# EAGLE design PentaFnord_0_2b (EAGLE 5.11)
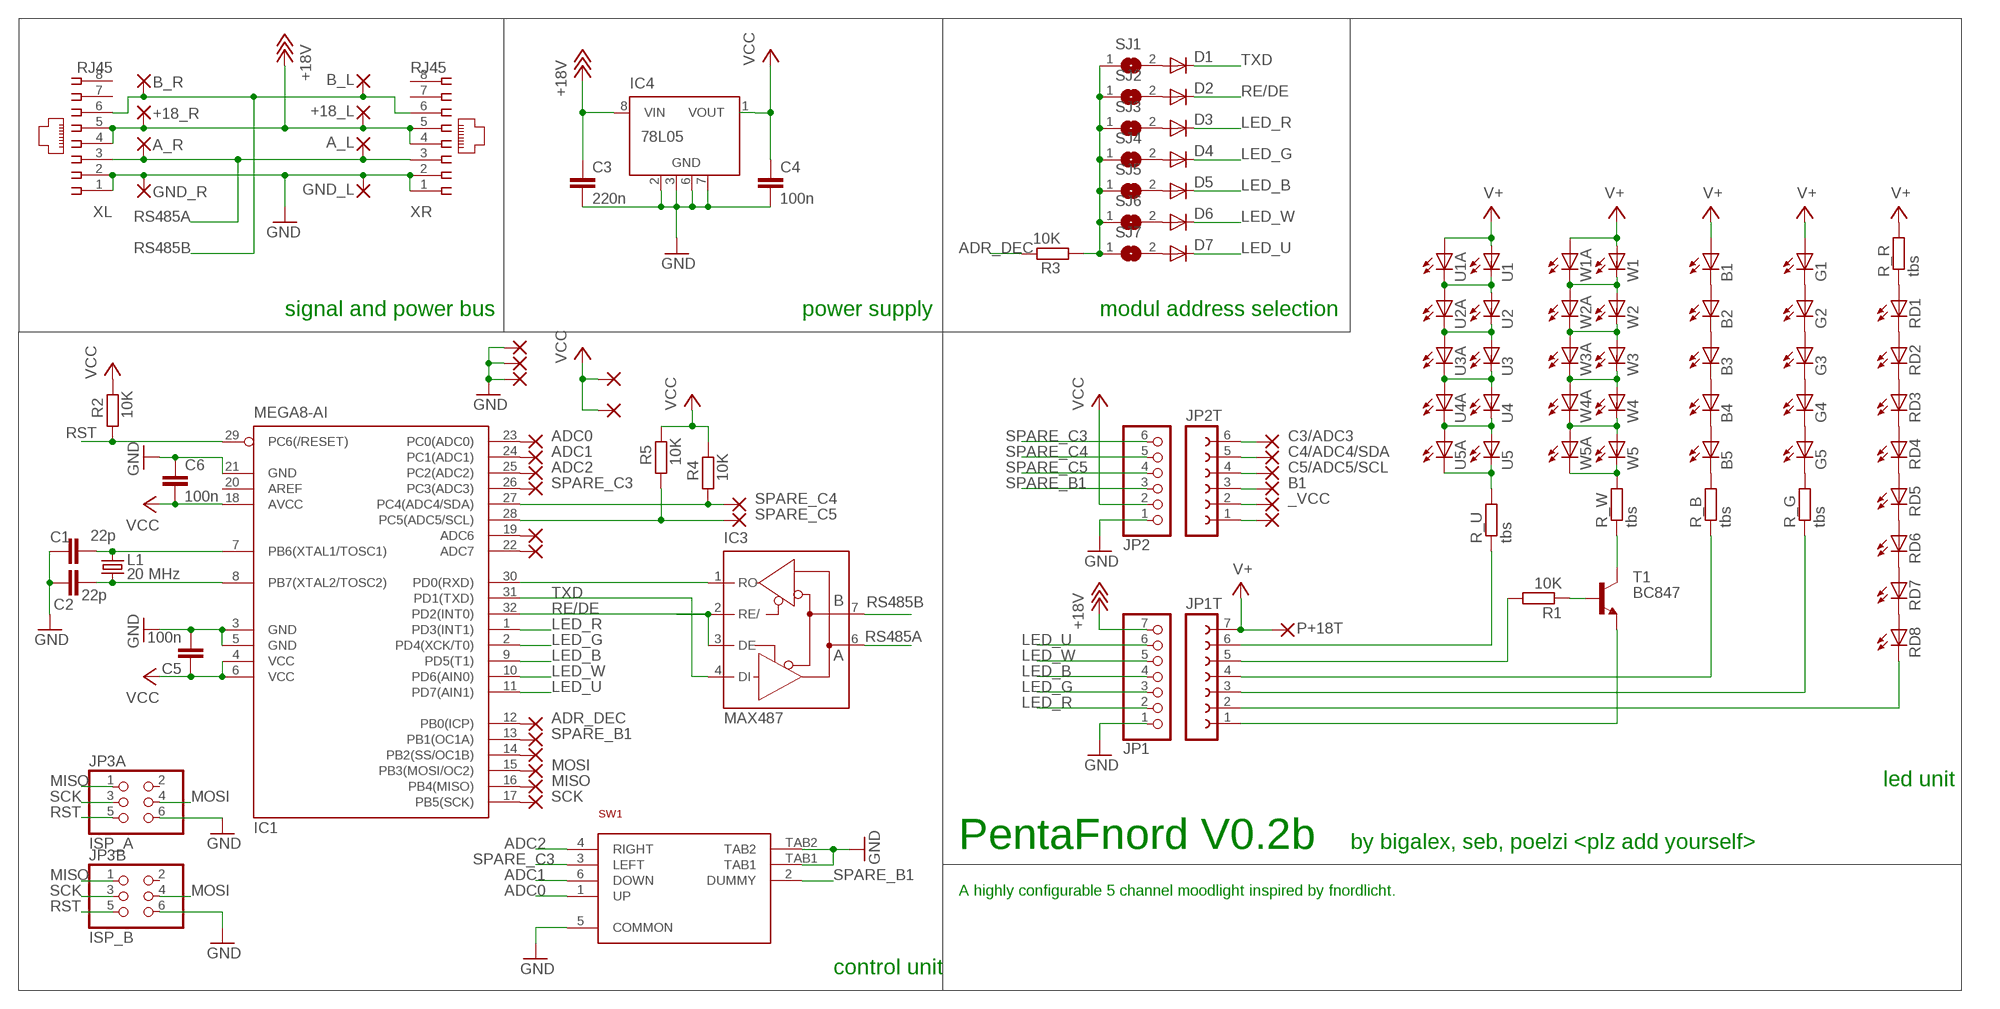
[diagram p0: schematic, sheet 1]

## Parts
+18_L  WIREPADSMD2,54-5,08  [SMD2,54-5,08]
+18_R  WIREPADSMD2,54-5,08  [SMD2,54-5,08]
A_L  WIREPADSMD2,54-5,08  [SMD2,54-5,08]
A_R  WIREPADSMD2,54-5,08  [SMD2,54-5,08]
ADC6  WIREPADSMD1,27-254  [SMD1,27-2,54]
ADC7  WIREPADSMD1,27-254  [SMD1,27-2,54]
B1  LED5MM  [LED5MM]
B2  LED5MM  [LED5MM]
B3  LED5MM  [LED5MM]
B4  LED5MM  [LED5MM]
B5  LED5MM  [LED5MM]
B_L  WIREPADSMD2,54-5,08  [SMD2,54-5,08]
B_R  WIREPADSMD2,54-5,08  [SMD2,54-5,08]
C1  22p  CAP0805  [0805]
C2  22p  CAP0805  [0805]
C3  220n  C-EUC0805  [C0805]
C4  100n  C-EUC0805  [C0805]
C5  100n  CAP0805  [0805]
C6  100n  CAP0805  [0805]
D1  DIODE-MINIMELF  [MINIMELF]
D2  DIODE-MINIMELF  [MINIMELF]
D3  DIODE-MINIMELF  [MINIMELF]
D4  DIODE-MINIMELF  [MINIMELF]
D5  DIODE-MINIMELF  [MINIMELF]
D6  DIODE-MINIMELF  [MINIMELF]
D7  DIODE-MINIMELF  [MINIMELF]
G1  LED5MM  [LED5MM]
G2  LED5MM  [LED5MM]
G3  LED5MM  [LED5MM]
G4  LED5MM  [LED5MM]
G5  LED5MM  [LED5MM]
GND_L  WIREPADSMD2,54-5,08  [SMD2,54-5,08]
GND_R  WIREPADSMD2,54-5,08  [SMD2,54-5,08]
IC1  MEGA8-AI  [TQFP32-08]
IC3  MAX487  [SO08]
IC4  78L05  78L05SMD  [SO08]
JP1  PINHD-1X07_2.54-SMD  [1X07SMD]
JP1T  FE07-1  [FE07]
JP2  PINHD-1X06_2.54-SMD  [1X06SMD]
JP2T  FE06-1  [FE06]
JP3A  ISP_A  PINHD-2X03_2.54-SMD  [2X03SMD]
JP3B  ISP_B  PINHD-2X03_2.54-SMD  [2X03SMD]
L1  20 MHz  X22-OSCILLATOR  [X22]
P+5T  WIREPAD2,54/0,8  [2,54/0,8]
P+18T  WIREPAD2,54/0,8  [2,54/0,8]
PAD1  WIREPADSMD1,27-254  [SMD1,27-2,54]
PAD2  WIREPADSMD1,27-254  [SMD1,27-2,54]
PAD3  WIREPADSMD1,27-254  [SMD1,27-2,54]
PAD4  WIREPADSMD1,27-254  [SMD1,27-2,54]
PAD5  WIREPADSMD1,27-254  [SMD1,27-2,54]
PB0  WIREPADSMD1,27-254  [SMD1,27-2,54]
PB1  WIREPADSMD1,27-254  [SMD1,27-2,54]
PB1T  WIREPAD2,54/0,8  [2,54/0,8]
PB2  WIREPADSMD1,27-254  [SMD1,27-2,54]
PB3  WIREPADSMD1,27-254  [SMD1,27-2,54]
PB4  WIREPADSMD1,27-254  [SMD1,27-2,54]
PB5  WIREPADSMD1,27-254  [SMD1,27-2,54]
PC0  WIREPADSMD1,27-254  [SMD1,27-2,54]
PC1  WIREPADSMD1,27-254  [SMD1,27-2,54]
PC2  WIREPADSMD1,27-254  [SMD1,27-2,54]
PC3  WIREPADSMD1,27-254  [SMD1,27-2,54]
PC3T  WIREPAD2,54/0,8  [2,54/0,8]
PC4  WIREPADSMD1,27-254  [SMD1,27-2,54]
PC4T  WIREPAD2,54/0,8  [2,54/0,8]
PC5  WIREPADSMD1,27-254  [SMD1,27-2,54]
PC5T  WIREPAD2,54/0,8  [2,54/0,8]
PGNDT1  WIREPAD2,54/0,8  [2,54/0,8]
R1  10K  R-EU_M0805  [M0805]
R2  10K  R-EU_M0805  [M0805]
R3  10K  R-EU_M0805  [M0805]
R4  10K  R-EU_M0805  [M0805]
R5  10K  R-EU_M0805  [M0805]
R_B  tbs  R-EU_M0805  [M0805]
R_G  tbs  R-EU_M0805  [M0805]
R_R  tbs  R-EU_M0805  [M0805]
R_U  tbs  R-EU_M0805  [M0805]
R_W  tbs  R-EU_M1206  [M1206]
RD1  LED5MM  [LED5MM]
RD2  LED5MM  [LED5MM]
RD3  LED5MM  [LED5MM]
RD4  LED5MM  [LED5MM]
RD5  LED5MM  [LED5MM]
RD6  LED5MM  [LED5MM]
RD7  LED5MM  [LED5MM]
RD8  LED5MM  [LED5MM]
SJ1  SJ  [SJ]
SJ2  SJ  [SJ]
SJ3  SJ  [SJ]
SJ4  SJ  [SJ]
SJ5  SJ  [SJ]
SJ6  SJ  [SJ]
SJ7  SJ  [SJ]
SW1  MCMT5-F-V  [MCMT5-F-V]
T1  BC847  [SOT23]
U1  NICHIA_NSSL157T-H3  LED_PLCC2  [PLCC2]
U1A  LED5MM  [LED5MM]
U2  NICHIA_NSSL157T-H3  LED_PLCC2  [PLCC2]
U2A  LED5MM  [LED5MM]
U3  NICHIA_NSSL157T-H3  LED_PLCC2  [PLCC2]
U3A  LED5MM  [LED5MM]
U4  NICHIA_NSSL157T-H3  LED_PLCC2  [PLCC2]
U4A  LED5MM  [LED5MM]
U5  NICHIA_NSSL157T-H3  LED_PLCC2  [PLCC2]
U5A  LED5MM  [LED5MM]
W1  NICHIA_NSSL157T-H3  [NICHIA_NSSL157T-H3]
W1A  LED5MM  [LED5MM]
W2  NICHIA_NSSL157T-H3  [NICHIA_NSSL157T-H3]
W2A  LED5MM  [LED5MM]
W3  NICHIA_NSSL157T-H3  [NICHIA_NSSL157T-H3]
W3A  LED5MM  [LED5MM]
W4  NICHIA_NSSL157T-H3  [NICHIA_NSSL157T-H3]
W4A  LED5MM  [LED5MM]
W5  NICHIA_NSSL157T-H3  [NICHIA_NSSL157T-H3]
W5A  LED5MM  [LED5MM]
XL  RJ45  RJ45-SMDRJ45  [85502-5008]
XR  RJ45  RJ45-SMDRJ45  [85502-5008]

## Nets
+18V: +18_L.1(P) +18_R.1(P) C3.1 IC4.8(VIN) JP1.7 XL.4 XL.5 XR.4 XR.5
_VCC: JP2T.2 P+5T.1(P)
ADC0: IC1.23(PC0(ADC0)) PC0.1(P) SW1.1(UP)
ADC1: IC1.24(PC1(ADC1)) PC1.1(P) SW1.6(DOWN)
ADC2: IC1.25(PC2(ADC2)) PC2.1(P) SW1.4(RIGHT)
ADR_DEC: IC1.12(PB0(ICP)) PB0.1(P) R3.2
B1: JP2T.3 PB1T.1(P)
C3/ADC3: JP2T.6 PC3T.1(P)
C4/ADC4/SDA: JP2T.5 PC4T.1(P)
C5/ADC5/SCL: JP2T.4 PC5T.1(P)
GND: C1.1 C2.1 C3.2 C4.2 C5.2 C6.1 GND_L.1(P) GND_R.1(P) IC1.3(GND) IC1.5(GND) IC1.21(GND) IC4.2(GND) IC4.3(GND) IC4.6(GND) IC4.7(GND) JP1.1 JP2.1 JP3A.6 JP3B.6 PAD1.1(P) PAD4.1(P) PAD5.1(P) SW1.5(COMMON) SW1.TAB1 SW1.TAB2 XL.1 XL.2 XR.1 XR.2
GND_T: JP1T.1 JP2T.1 PGNDT1.1(P) T1.2(E)
LED_B: D5.C IC1.9(PD5(T1)) JP1.4
LED_G: D4.C IC1.2(PD4(XCK/T0)) JP1.3
LED_R: D3.C IC1.1(PD3(INT1)) JP1.2
LED_U: D7.C IC1.11(PD7(AIN1)) JP1.6
LED_W: D6.C IC1.10(PD6(AIN0)) JP1.5
MISO: IC1.16(PB4(MISO)) JP3A.1 JP3B.1 PB4.1(P)
MOSI: IC1.15(PB3(MOSI/OC2)) JP3A.4 JP3B.4 PB3.1(P)
N$1: G5.K(C) R_G.2
N$2: W4.K@1(C) W4A.K(C) W5.A@2(A) W5A.A
N$3: U1.P$1(C) U1A.K(C) U2.P$2(A) U2A.A
N$4: ADC6.1(P) IC1.19(ADC6)
N$5: U3.P$1(C) U3A.K(C) U4.P$2(A) U4A.A
N$6: R_U.2 U5.P$1(C) U5A.K(C)
N$7: R_W.2 W5.K@1(C) W5A.K(C)
N$8: W3.K@1(C) W3A.K(C) W4.A@2(A) W4A.A
N$9: ADC7.1(P) IC1.22(ADC7)
N$10: U2.P$1(C) U2A.K(C) U3.P$2(A) U3A.A
N$11: B1.K(C) B2.A
N$12: U4.P$1(C) U4A.K(C) U5.P$2(A) U5A.A
N$13: G1.K(C) G2.A
N$14: G2.K(C) G3.A
N$15: G3.K(C) G4.A
N$16: G4.K(C) G5.A
N$17: B2.K(C) B3.A
N$18: B3.K(C) B4.A
N$19: B4.K(C) B5.A
N$20: B5.K(C) R_B.2
N$21: RD1.K(C) RD2.A
N$22: RD2.K(C) RD3.A
N$23: RD3.K(C) RD4.A
N$24: RD4.K(C) RD5.A
N$25: RD5.K(C) RD6.A
N$26: RD6.K(C) RD7.A
N$27: R_R.1 RD1.A
N$28: RD7.K(C) RD8.A
N$32: IC1.30(PD0(RXD)) IC3.1(RO)
N$34: W2.K@1(C) W2A.K(C) W3.A@2(A) W3A.A
N$35: C1.2 IC1.7(PB6(XTAL1/TOSC1)) L1.3
N$36: C2.2 IC1.8(PB7(XTAL2/TOSC2)) L1.1
N$37: R_W.1 T1.3(C)
N$38: R1.1 T1.1(B)
N$39: JP1T.6 R_U.1
N$40: JP1T.5 R1.2
N$41: JP1T.3 R_G.1
N$42: JP1T.4 R_B.1
N$43: JP1T.2 RD8.K(C)
N$45: D1.A SJ1.2
N$46: D2.A SJ2.2
N$47: D3.A SJ3.2
N$48: D4.A SJ4.2
N$50: D5.A SJ5.2
N$51: D6.A SJ6.2
N$52: D7.A SJ7.2
N$53: R3.1 SJ1.1 SJ2.1 SJ3.1 SJ4.1 SJ5.1 SJ6.1 SJ7.1
N$54: W1.K@1(C) W1A.K(C) W2.A@2(A) W2A.A
N$55: IC1.14(PB2(SS/OC1B)) PB2.1(P)
RE/DE: D2.C IC1.32(PD2(INT0)) IC3.2(RE/) IC3.3(DE)
RS485A: A_L.1(P) A_R.1(P) IC3.6(A) XL.3 XR.3
RS485B: B_L.1(P) B_R.1(P) IC3.7(B) XL.6 XR.6
RST: IC1.29(PC6(/RESET)) JP3A.5 JP3B.5 R2.1
SCK: IC1.17(PB5(SCK)) JP3A.3 JP3B.3 PB5.1(P)
SPARE_B1: IC1.13(PB1(OC1A)) JP2.3 PB1.1(P) SW1.2(DUMMY)
SPARE_C3: IC1.26(PC3(ADC3)) JP2.6 PC3.1(P) SW1.3(LEFT)
SPARE_C4: IC1.27(PC4(ADC4/SDA)) JP2.5 PC4.1(P) R4.1
SPARE_C5: IC1.28(PC5(ADC5/SCL)) JP2.4 PC5.1(P) R5.1
TXD: D1.C IC1.31(PD1(TXD)) IC3.4(DI)
V+: B1.A G1.A JP1T.7 P+18T.1(P) R_R.2 U1.P$2(A) U1A.A W1.A@2(A) W1A.A
VCC: C4.1 C5.1 C6.2 IC1.4(VCC) IC1.6(VCC) IC1.18(AVCC) IC4.1(VOUT) JP2.2 PAD2.1(P) PAD3.1(P) R2.2 R4.2 R5.2
Unconnected: IC1.20(AREF) IC4.4(NC) IC4.5(NC) JP3A.2 JP3B.2 XL.7 XL.8 XR.7 XR.8

## Notes on the sheet
- signal and power bus | power supply | modul address selection
- led unit
- PentaFnord V0.2b | by bigalex, seb, poelzi <plz add yourself>
- A highly configurable 5 channel moodlight inspired by fnordlicht.
- control unit

## Power pins joined to a net without a drawn wire
GND: IC3.5(GND)
VCC: IC3.8(VCC)

## Library data of the parts
+18_L +18_R A_L A_R ADC6 ADC7 B_L B_R GND_L GND_R P+5T P+18T PAD1-PAD5 PB0 PB1 PB1T PB2-PB5 PC0 PC1-PC3 PC3T PC4 PC4T PC5 PC5T PGNDT1 = wirepad:WIREPAD: Wire PAD connect wire on PCB
B1-B5 G1-G5 RD1-RD8 U1A U2A U3A U4A U5A W1A W2A W3A W4A W5A = Alex_personal:LED: LED OSRAM: - CHIPLED LG R971, LG N971, LY N971, LG Q971, LY Q971, LO R971, LY R971 LH N974, LH R974 LS Q976, LO Q976, LY Q976 LO Q996 - Hyper CHIPLED LW Q18S LB Q993, LB Q99A, LB R99A - SideLED LS A670, LO A670, LY A670, LG A670, LP A670 LB A673, LV A673, LT A673, LW A673 LH A674 LY A675 LS A676, LA A676, LO A676, LY A676, LW A676 LS A679, LY A679, LG A679 - Hyper Micro SIDELED® LS Y876, LA Y876, LO Y876, LY Y876 LT Y87S - SmartLED LW L88C, LW L88S LB L89C, LB L89S, LG L890 LS L89K, LO L89K, LY L89K LS L896, LA L896, LO L896, LY L896 - TOPLED LS T670, LO T670, LY T670, LG T670, LP T670 LSG T670, LSP T670, LSY T670, LOP T670, LYG T670 LG T671, LOG T671, LSG T671 LB T673, LV T673, LT T673, LW T673 LH T674 LS T676, LA T676, LO T676, LY T676, LB T676, LH T676, LSB T676, LW T676 LB T67C, LV T67C, LT T67C, LS T67K, LO T67K, LY T67K, LW E67C LS E67B, LA E67B, LO E67B, LY E67B, LB E67C, LV E67C, LT E67C LW T67C LS T679, LY T679, LG T679 LS T770, LO T770, LY T770, LG T770, LP T770 LB T773, LV T773, LT T773, LW T773 LH T774 LS E675, LA E675, LY E675, LS T675 LS T776, LA T776, LO T776, LY T776, LB T776 LHGB T686 LT T68C, LB T68C - Hyper Mini TOPLED® LB M676 - Mini TOPLED Santana® LG M470 LS M47K, LO M47K, LY M47K Source: http://www.osram.convergy.de LUXEON: - LUMILED® LXK2-PW12-R00, LXK2-PW12-S00, LXK2-PW14-U00, LXK2-PW14-V00 LXK2-PM12-R00, LXK2-PM12-S00, LXK2-PM14-U00 LXK2-PE12-Q00, LXK2-PE12-R00, LXK2-PE12-S00, LXK2-PE14-T00, LXK2-PE14-U00 LXK2-PB12-K00, LXK2-PB12-L00, LXK2-PB12-M00, LXK2-PB14-N00, LXK2-PB14-P00, LXK2-PB14-Q00 LXK2-PR12-L00, LXK2-PR12-M00, LXK2-PR14-Q00, LXK2-PR14-R00 LXK2-PD12-Q00, LXK2-PD12-R00, LXK2-PD12-S00 LXK2-PH12-R00, LXK2-PH12-S00 LXK2-PL12-P00, LXK2-PL12-Q00, LXK2-PL12-R00 Source: www.luxeon.com KINGBRIGHT: KA-3528ASYC Source: www.kingbright.com
C1 C2 C5 C6 = SparkFun:CAP: Capacitor Standard 0603 ceramic capacitor, and 0.1" leaded capacitor.
C3 C4 = rcl:C-EU: CAPACITOR, European symbol
D1-D7 = diode:DIODE-: DIODE
IC1 = atmel:MEGA8: MICROCONTROLLER 8 Kbytes FLASH, 1 kbytes SRAM, 512 bytes EEPROM, USART, 6-channel 10 bit ADC, 2-channel 8 bit ADC Pin compatible with Atmega48, ATMega88, ATMega168 Source: avr.lbr; MPN: ATMEGA8-16AU; OC_FARNELL: 9171371; OC_NEWARK: 73M8863
IC3 = Alex_personal:MAX487: RS485 TRANSEIVER; MF: MAXIM; MPN: MAX487; OC_FARNELL: unknown; OC_NEWARK: unknown
IC4 = linear:78L*SMD: Positive VOLTAGE REGULATOR
JP1 = pinhead-2:PINHD-1X07: PIN HEADER
JP1T = con-lsta:FE07-1: FEMALE HEADER; OC_FARNELL: unknown; OC_NEWARK: unknown
JP2 = pinhead-2:PINHD-1X06: PIN HEADER
JP2T = con-lsta:FE06-1: FEMALE HEADER; OC_FARNELL: unknown; OC_NEWARK: unknown
JP3A JP3B = pinhead-2:PINHD-2X03: PIN HEADER
L1 = seb:X22-OSCILLATOR
R1-R5 R_B R_G R_R R_U R_W = rcl:R-EU_: RESISTOR, European symbol
SJ1-SJ7 = jumper:SJ: SMD solder JUMPER
SW1 = badge:MCMT5-F-V
T1 = transistor:BC847: NPN TRANSISTOR
U1-U5 = seb:LED_PLCC2
W1-W5 = seb:NICHIA_NSSL157T-H3
XL XR = Alex_personal:RJ45-SMD: AMP connector; MOLEX: 85502-5008; OC_FARNELL: 1331561

## Board
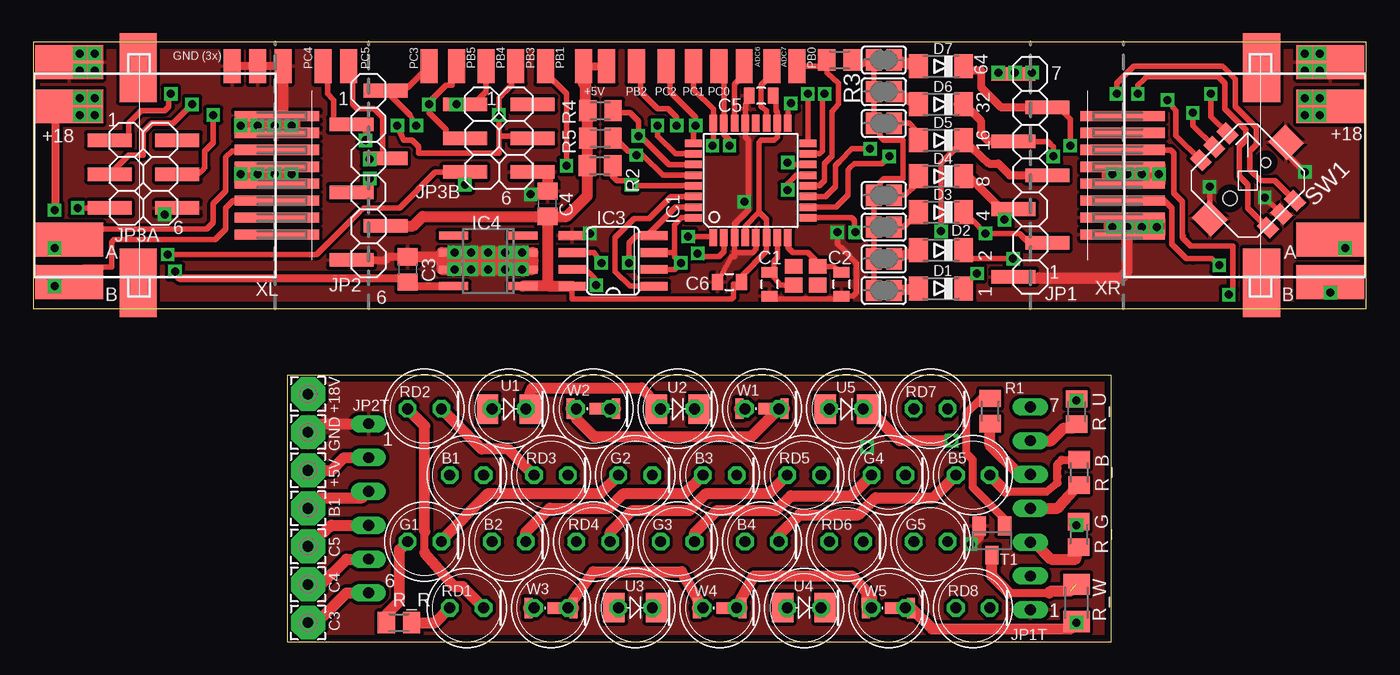
[diagram p1: board, top side]
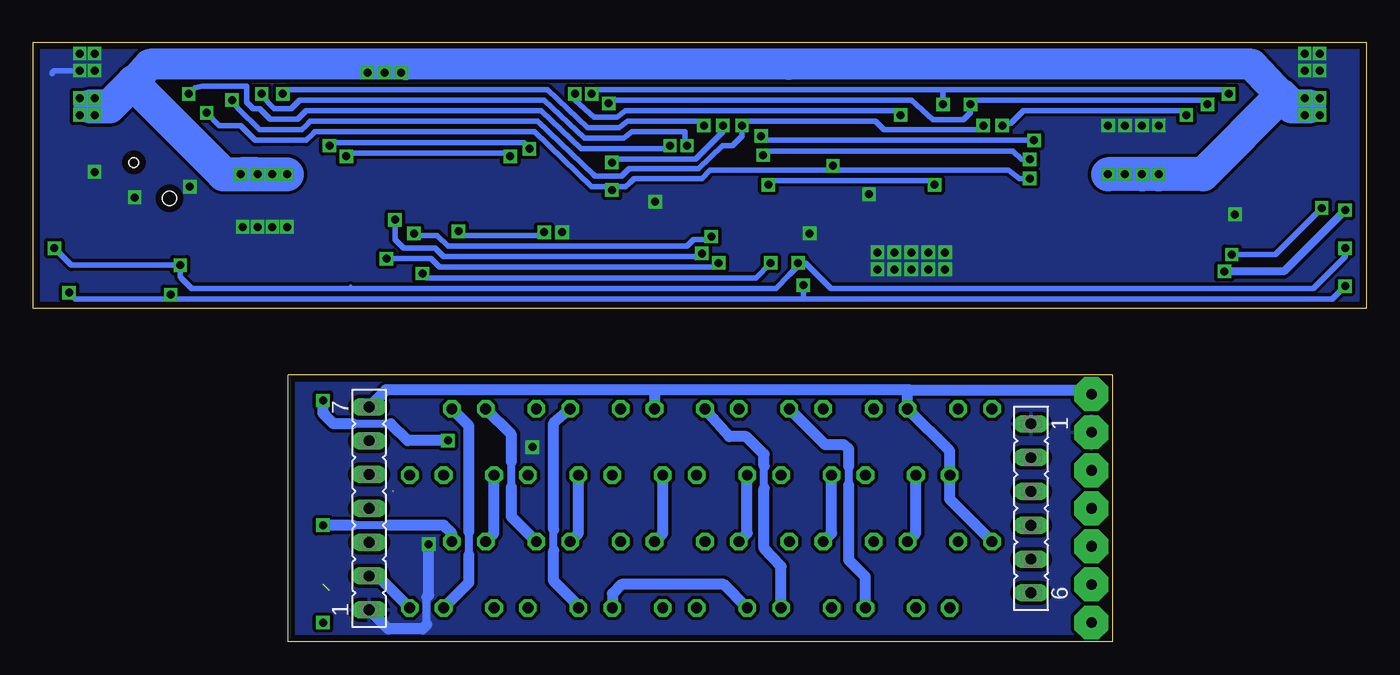
[diagram p2: board, bottom side, seen from below]

Size 100 x 45 mm. Coordinates in mm from the lower left corner, seen from the top.
Outline: 19.05,0 80.9,0 80.9,20 19.05,20 19.05,0
Outline: 100,25 100,45 0,45 0,25 100,25
Copper layers (1*16): Top 0.035mm / dielectric 1.5mm / Bottom 0.035mm
Design rules "default *": minimum track width 10mil, minimum drill 0.4mm, track to track 10mil, track to pad 10mil, pad to pad 8mil, via to via 10mil, smd to smd 8mil, copper to edge 20mil, drill to drill 8mil, minimum pad ring 10mil, minimum via ring 8mil, stop-mask expansion 4mil, vias tented up to drill 0mil, thermal gap 10mil

### Footprints (pad centres in the part's own frame; a part is rotated, then mirrored left to right if it is on the bottom)
SMD2,54-5,08 = smd 2.54 x 5.08: 1 0,0
SMD1,27-2,54 = smd 1.27 x 2.54: 1 0,0
LED5MM = drill 0.813 octagon: A -1.27,0; K 1.27,0
0805 = smd 0.8 x 1.2: 1 -0.9,0; 2 0.9,0
C0805 = smd 1.3 x 1.5: 1 -0.95,0; 2 0.95,0
MINIMELF = smd 1.4 x 1.8: A 1.7,0; C -1.7,0
TQFP32-08 = smd 1.27 x 0.559: 1 -4.293,2.8; 2 -4.293,2; 3 -4.293,1.2; 4 -4.293,0.4; 5 -4.293,-0.4; 6 -4.293,-1.2; 7 -4.293,-2; 8 -4.293,-2.8; 17 4.293,-2.8; 18 4.293,-2; 19 4.293,-1.2; 20 4.293,-0.4; 21 4.293,0.4; 22 4.293,1.2; 23 4.293,2; 24 4.293,2.8 | smd 0.559 x 1.27: 9 -2.8,-4.293; 10 -2,-4.293; 11 -1.2,-4.293; 12 -0.4,-4.293; 13 0.4,-4.293; 14 1.2,-4.293; 15 2,-4.293; 16 2.8,-4.293; 25 2.8,4.293; 26 2,4.293; 27 1.2,4.293; 28 0.4,4.293; 29 -0.4,4.293; 30 -1.2,4.293; 31 -2,4.293; 32 -2.8,4.293
SO08 = smd 0.66 x 2.032: 1 -1.905,-3.073; 2 -0.635,-3.073; 3 0.635,-3.073; 4 1.905,-3.073; 5 1.905,3.073; 6 0.635,3.073; 7 -0.635,3.073; 8 -1.905,3.073
SO08' = smd 0.6 x 2.2: 1 -1.905,-2.6; 2 -0.635,-2.6; 3 0.635,-2.6; 4 1.905,-2.6; 5 1.905,2.6; 6 0.635,2.6; 7 -0.635,2.6; 8 -1.905,2.6
1X07SMD = smd 1.016 x 3.302: 1 -1.27,1.27; 2 1.27,-1.27; 3 3.81,1.27; 4 6.35,-1.27; 5 8.89,1.27; 6 11.43,-1.27; 7 13.97,1.27
FE07 = drill 0.813 long: 1 -7.62,0; 2 -5.08,0; 3 -2.54,0; 4 0,0; 5 2.54,0; 6 5.08,0; 7 7.62,0
1X06SMD = smd 1.016 x 3.302: 1 -1.27,1.27; 2 1.27,-1.27; 3 3.81,1.27; 4 6.35,-1.27; 5 8.89,1.27; 6 11.43,-1.27
FE06 = drill 0.813 long: 1 -6.35,0; 2 -3.81,0; 3 -1.27,0; 4 1.27,0; 5 3.81,0; 6 6.35,0
2X03SMD = smd 1.016 x 3.302: 1 -1.27,-3.81; 2 -1.27,1.27; 3 1.27,-3.81; 4 1.27,1.27; 5 3.81,-3.81; 6 3.81,1.27
X22 = smd 1.3 x 1.1: 1 0.9,0.7; 2 -0.9,0.7; 3 -0.9,-0.7; 4 0.9,-0.7
2,54/0,8 = drill 0.813 pad 2.54 octagon: 1 0,0
M0805 = smd 1.3 x 1.6: 1 -0.95,0; 2 0.95,0
M1206 = smd 1.6 x 2: 1 -1.4,0; 2 1.4,0
SJ = smd 1.168 x 1.6: 1 -0.762,0; 2 0.762,0
MCMT5-F-V = smd 1.35 x 1: 1 -3.575,1.425; 2 -3.575,0; 3 -3.575,-1.425; 4 3.575,1.425; 5 3.575,0; 6 3.575,-1.425 | smd 2 x 1.8: TAB1 0,4.05; TAB2 0,-4.05 | hole 1.05: 0,-1.9 | hole 0.75: 0,1.9
SOT23 = smd 1 x 1.4: 1 -0.95,-1.1; 2 0.95,-1.1; 3 0,1.1
PLCC2 = smd 1.6 x 2.2: P$1 -1.6,0; P$2 1.6,0
NICHIA_NSSL157T-H3 = smd 0.64 x 0.86: A@1 1.08,0 | smd 0.6 x 1.55: A@2 1.7,0; K@1 -1.7,0 | smd 1.66 x 0.86: K@2 -0.57,0
85502-5008 = smd 6.35 x 0.762: 1 10.338,4.445; 2 10.338,3.175; 3 10.338,1.905; 4 10.338,0.635; 5 10.338,-0.635; 6 10.338,-1.905; 7 10.338,-3.175; 8 10.338,-4.445 | smd 2.794 x 5.156: P$1 -0.076,-8.077; P$2 -0.076,8.077

### Placement (x,y rotation side)
+18_L  2.7,40.16 90 top
+18_R  97.31,40.16 90 top
A_L  2.7,30.16 90 top
A_R  97.31,30.16 90 top
ADC6  55.4,43.18 0 top
ADC7  53.34,43.18 180 top
B1  32.51,12.49 0 top
B2  35.68,7.51 0 top
B3  51.5,12.49 0 top
B4  54.67,7.51 0 top
B5  70.49,12.49 0 top
B_L  2.7,26.99 90 top
B_R  97.31,26.99 90 top
C1  55.24,26.83 90 top
C2  60.64,26.83 90 top
C3  28.1,27.94 90 top
C4  38.58,32.86 90 top
C5  54.61,40.96 180 top
C6  52.23,26.99 0 top
D1  68.1,26.51 180 top
D2  68.1,29.37 180 top
D3  68.1,32.23 180 top
D4  68.1,34.92 180 top
D5  68.1,37.62 180 top
D6  68.1,40.32 180 top
D7  68.1,43.18 180 top
G1  29.35,7.51 0 top
G2  45.17,12.49 0 top
G3  48.34,7.51 0 top
G4  64.16,12.49 0 top
G5  67.33,7.51 0 top
GND_L  2.7,43.5 90 top
GND_R  97.31,43.5 90 top
IC1  53.82,34.61 90 top
IC3  43.5,28.57 90 top
IC4  78L05  [SO08']  34.13,28.58 90 top
JP1  74.8,28.65 90 top
JP1T  74.8,10 90 bottom
JP2  25.15,29.92 90 top
JP2T  25.15,10 270 bottom
JP3A  9.53,36.35 270 top
JP3B  36.2,39.05 270 top
L1  57.94,27.46 0 top
P+5T  20.61,12.86 0 top
P+18T  20.61,18.57 0 top
PAD1  14.92,43.18 0 top
PAD2  43.02,43.18 0 top
PAD3  41.27,43.18 0 top
PAD4  16.83,43.18 0 top
PAD5  18.73,43.18 0 top
PB0  57.31,43.18 180 top
PB1  38.42,43.18 180 top
PB1T  20.61,10 0 top
PB2  45.24,43.18 180 top
PB3  36.19,43.18 180 top
PB4  33.97,43.18 180 top
PB5  31.75,43.18 180 top
PC0  51.44,43.18 0 top
PC1  49.53,43.18 0 top
PC2  47.47,43.18 0 top
PC3  29.69,43.18 0 top
PC3T  20.61,1.43 0 top
PC4  21.75,43.18 0 top
PC4T  20.61,4.29 0 top
PC5  23.65,43.18 0 top
PC5T  20.61,7.14 0 top
PGNDT1  20.61,15.72 0 top
R1  71.79,17.3 270 top
R2  42.51,35.72 180 top
R3  60.48,43.66 180 top
R4  42.54,39.85 180 top
R5  42.55,37.78 180 top
R_B  78.45,12.7 90 top
R_G  78.42,8.05 90 top
R_R  27.43,1.43 180 top
R_U  78.26,17.26 90 top
R_W  78.26,2.9 270 top
RD1  32.51,2.53 0 top
RD2  29.35,17.47 0 top
RD3  38.84,12.49 0 top
RD4  42.01,7.51 0 top
RD5  57.83,12.49 0 top
RD6  61,7.51 0 top
RD7  67.33,17.47 0 top
RD8  70.49,2.53 0 top
SJ1  63.82,26.35 0 top
SJ2  63.82,28.73 0 top
SJ3  63.82,31.12 0 top
SJ4  63.82,33.5 0 top
SJ5  63.82,38.89 0 top
SJ6  63.82,41.28 0 top
SJ7  63.82,43.66 0 top
SW1  91.12,34.61 315 top
T1  71.91,7.59 180 top
U1  35.68,17.45 180 top
U1A  35.68,17.47 0 top
U2  48.34,17.46 180 top
U2A  48.34,17.47 0 top
U3  45.16,2.55 180 top
U3A  45.17,2.53 0 top
U4  57.82,2.55 180 top
U4A  57.83,2.53 0 top
U5  61,17.46 180 top
U5A  61,17.47 0 top
W1  54.67,17.47 180 top
W1A  54.67,17.47 0 top
W2  42.01,17.47 180 top
W2A  42.01,17.47 0 top
W3  38.84,2.53 180 top
W3A  38.84,2.53 0 top
W4  51.5,2.53 180 top
W4A  51.5,2.53 0 top
W5  64.16,2.53 180 top
W5A  64.16,2.53 0 top
XL  7.94,35 0 top
XR  92.08,35 180 top

### Tracks (layer width: path | path; a pad name or v marks a point on that pad's centre or on a via)
+18V  (via drill 0.6)
  Top 0.254: XR.4 83.74,34.37 arc90 v84.45,35.08 | v18.1,35.08 17.78,35.56 XL.4 19.05,35.56 v19.37,35.08
  Top 0.406: +18_R.1 97.16,40.16 v96.52,39.53 | v3.49,40.8 2.86,40.16 +18_L.1 | XR.5 83.9,35.63 arc-90 v84.45,35.08 | JP1.7 72.47,42.62 arc-90 v72.39,42.7 | XL.4 XL.5 | C3.1 arc90 28.42,26.67
  Top 0.61: IC4.8 28.42,26.67 C3.1 27.78,27.3 10.95,27.3 v10.64,27.78 | 1.67,39.61 2.22,40.16 3.81,40.16 3.81,40.32 4.45,40.96 4.45,40.64 4.92,40.16 +18_L.1 | 1.67,39.61 1.59,39.53 | +18_L.1 | v1.59,32.38 1.67,32.46 1.67,39.61
  Bottom 0.406: 95.73,40.16 v96.52,39.53 | 4.29,40.16 3.49,40.48 v3.49,40.8 | v72.39,42.7 72.39,42.86 arc90 72.07,43.33 | 42.55,43.81 43.34,43.81 43.34,43.33 | v15.56,35.08 16.51,36.04
  Bottom 0.61: v1.59,32.38 6.19,27.78 v10.64,27.78
  Bottom 2.311: 92.47,41.99 91.28,43.33 72.07,43.33 43.34,43.33 8.57,43.33 6.35,40.96
  Bottom 2.54: 95.73,40.16 94.3,40.16 92.47,41.99 92.47,41.83 85.72,35.08 v83.19,35.08 | 4.29,40.16 5.56,40.16 6.35,40.96 12.22,35.08 v15.56,35.08 v16.83,35.08 v19.37,35.08 | v83.19,35.08 v82.07,35.08 v80.96,35.08 | v83.19,35.08 v84.45,35.08
_VCC
  Top 0.813: JP2T.2 23.34,13.81 22.38,12.86 P+5T.1
ADC0  (via drill 0.6)
  Top 0.406: PC0.1 51.82,43.12 IC1.23 51.82,38.04 52.23,37.62 v52.23,37.23 | v88.34,41.12 88.34,39.4 SW1.1
  Bottom 0.254: 80.01,39.37 | 80.01,39.37
  Bottom 0.406: 80.01,39.37 79.53,39.85 61.91,39.85 58.9,36.99 52.47,36.99 v52.23,37.23 | 80.01,39.37 | 80.01,39.37 | 80.01,39.37 80.17,39.21 82.23,39.21 83.03,40.01 83.19,40.01 83.5,40.01 83.98,40.48 83.98,41.12 83.98,41.67 87.31,41.67 87.87,41.59 v88.34,41.12
ADC1  (via drill 0.6)
  Top 0.254: SW1.6 92.71,30.48 | v50.96,37.23 50.8,36.83
  Top 0.406: v50.96,37.23 51.02,36.93 IC1.24 51.02,39.95 49.53,41.43 PC1.1 | SW1.6 92.59,31.07 91.12,32.54 91.12,33.81 91.12,34.29 90.49,34.92 90.49,37.15 90.96,37.62 90.96,38.42 90.81,38.58 89.53,39.85 89.38,40.01 89.38,41.43 89.38,41.91 88.9,42.39 83.5,42.39 83.34,42.23 82.87,41.75 v82.87,41.12
  Bottom 0.406: v50.96,37.23 51.12,37.62 51.12,38.26 55.09,38.26 55.72,37.78 58.66,37.78 61.67,40.64 78.74,40.64 80.01,40.64 80.64,40.01 81.92,40.01 82.87,40.96 v82.87,41.12
ADC2  (via drill 0.6)
  Top 0.254: SW1.4 95.25,33.02
  Top 0.406: IC1.25 49.52,38.57 v49.69,38.73 49.69,39.37 47.78,41.27 47.78,42.86 PC2.1 | SW1.4 93.14,34.61 92.08,34.61 91.28,35.4 91.28,35.72 91.28,36.83 91.76,37.31 91.76,38.58 90.17,40.16 90.17,42.07 90.17,42.23 89.38,43.02 89.22,43.18 86.84,43.18 82.55,43.18 81.28,41.91 v81.28,41.12
  Bottom 0.406: v49.69,38.73 50.01,39.05 55.4,39.05 56.04,38.58 58.42,38.58 61.44,41.43 80.96,41.43 v81.28,41.12
ADR_DEC
  Top 0.406: IC1.12 58.97,34.21 59.37,34.61 59.37,35.88 59.93,36.43 59.93,39.77 60.4,40.32 60.4,41.91 59.53,42.7 R3.2 59.06,43.18 PB0.1
B1
  Top 0.813: PB1T.1 21.24,10.79 24.67,10.79 JP2T.3
C3/ADC3
  Top 0.813: JP2T.6 23.49,3.65 21.27,1.43 PC3T.1
C4/ADC4/SDA
  Top 0.813: JP2T.5 23.49,6.19 21.59,4.29 PC4T.1
C5/ADC5/SCL
  Top 0.813: JP2T.4 22.35,8.73 PC5T.1
GND  (via drill 0.6)
  Top 0.254: IC3.5 40.64,30.48 | C3.2 27.94,29.21
  Top 0.406: v96.52,42.86 GND_R.1 | C1.1 55.3,25.72 60.43,25.72 C2.1 61.49,25.93 61.75,26.19 61.75,28.42 60.8,29.37 60.33,29.84 v60.33,30.72 | C6.1 52.39,28.89 52.62,28.89 52.62,29.21 | IC4.3 IC4.2 | IC4.6 IC4.7 | C5.2 53.42,40.27 IC1.21 53.42,37.87 53.66,37.62 53.66,33.02 | C4.2 37.62,33.81 | 52.62,29.21 IC1.3 52.62,31.34 53.66,32.38 53.66,33.02 | IC1.5 54.22,29.45 53.98,29.21 52.62,29.21 | C4.2 38.26,33.5 | v36.67,29.21 37.47,29.21 | v3.49,42.86 2.7,42.86 | 40.64,30.48 41.75,30.48 v41.75,30.64 | 53.66,33.02 v53.34,33.02 | v88.27,34.13 v88.26,34.12 SW1.TAB2 | SW1.5 v92.39,33.34 | v95.41,35.24 93.99,36.66 SW1.TAB1 | v37.31,33.58 37.46,33.81 C4.2
  Top 0.61: JP2.1 26.43,28.65 arc90 26.51,28.73 26.67,28.89 C3.2 | JP3A.6 10.95,32.38 | JP3A.6 11.59,32.54 | v9.84,32.07 9.84,32.54 JP3A.6 | PAD5.1 PAD4.1 PAD1.1 | 3.02,43.18 3.49,43.18 3.25,42.94 3.02,43.18 | 3.02,43.18 GND_L.1 | 3.02,43.18
  Top 0.813: C4.2 38.58,35.24 37.94,35.24 JP3B.6 | IC4.6 IC4.3 36.73,28 v36.67,27.94 | 35.56,27.94 v36.67,27.94 | 35.56,27.94 v35.4,27.94 v34.13,27.94 v32.86,27.94 v31.59,27.94 30.64,27.94 30.64,28.89 | 30.64,28.89 30.64,29.21 v31.59,29.21 v32.86,29.21 v34.13,29.21 v35.4,29.21 v36.67,29.21 36.99,29.21 | 36.99,29.21 37.47,29.21 37.47,27.94 v36.67,27.94 | 35.56,27.94 36.2,28.57 | 36.2,28.57 30.96,28.57 | 36.2,28.57 36.35,28.57 36.99,29.21 | C3.2 30.64,28.89 | JP1.1 73.61,27.3 75.41,27.3 81.6,27.3 82.07,27.78 v82.07,31.11 | v82.07,31.11 v83.19,31.11 v84.3,31.11 | v82.07,31.11 v80.96,31.11 | v82.07,31.11 82.07,31.49 XR.2 | v82.07,31.11 82.07,30.89 XR.1 | v16.83,38.73 v15.56,38.73 v16.83,38.73 | v16.83,38.73 v18.1,38.73 | v18.1,38.73 v19.37,38.73 XL.2 18.73,38.63 PAD5.1 | v18.1,38.73 18.41,38.26 18.26,38.26
  Bottom 0.406: v96.52,42.86 98.33,42.86 arc-90 98.58,42.61
  other vias: 4.6,42.86 3.49,44.13 4.6,44.13 95.41,42.86 95.41,44.13 96.52,44.13
  pour Bottom: -0.16,24.92 100.17,24.92 100.17,45.09 -0.16,45.09
  pour Top: -0.16,45.09 100.17,45.09 100.17,24.92 -0.16,24.92
GND_T  (via drill 0.6)
  Top 0.813: v70.33,7.3 70.96,7.94 T1.2 | JP2T.1 21.08,16.35 PGNDT1.1
  Bottom 0.61: 70.48,1.27 70.48,3.33
  Bottom 0.813: 70.48,1.27 70.8,0.95 73.38,0.95 JP1T.1 | 70.48,3.33 70.33,3.49 v70.33,7.3
  other vias: 62.55,14.61
  pour Bottom: 19.05,20 80.96,20 80.96,0 19.05,0
  pour Top: 19.05,20 80.96,20 80.96,0 19.05,0
LED_B  (via drill 0.6)
  Top 0.406: D5.C 68.1,35.92 v68.1,30.8 | IC1.9 58.84,31.81 60.51,31.81 61.38,31.81 61.59,31.59 61.59,30.8 v61.67,30.72
  Top 0.61: JP1.4 73.27,35 72.39,35.88 71.71,35.88 D5.C
  Bottom 0.406: v68.1,30.8 67.79,30.48 63.82,30.48 61.83,30.48 v61.67,30.72
LED_G  (via drill 0.6)
  Top 0.406: 72.87,32.38 72.71,32.38 | 72.87,32.38 73.46,32.38 | 73.46,32.38 JP1.3 | 50.8,28.89 50.32,28.89 | 50.8,28.89 51.44,28.89 51.82,29.27 IC1.2 | 73.46,32.38 73.98,32.38 | v72.87,31.67 72.87,32.38 | v49.85,29.13 50.09,28.89 50.8,28.89
  Top 0.61: D4.C 70.01,35.08 72.71,32.38
  Bottom 0.406: v72.87,31.67 72.87,30.16 72.23,29.53 69.85,29.53 69.22,28.89 50.32,28.89 50.09,28.89 v49.85,29.13
LED_R  (via drill 0.6)
  Top 0.406: D3.C 69.8,32.11 70.33,31.59 70.48,31.59 v71.44,30.64 73.98,30.64 74.77,29.84 76,29.84 JP1.2 | IC1.1 50.93,30.4 v49.13,30.4
  Bottom 0.406: v71.44,30.64 71.28,30.48 69.69,30.48 68.9,29.69 51.91,29.69 50.96,29.69 50.48,30.16 49.85,30.16 49.37,30.16 v49.13,30.4
LED_U  (via drill 0.6)
  Top 0.406: 70.12,42.86 D7.C | IC1.11 59.44,33.41 59.85,33.81 60.17,34.13 60.17,35.72 60.48,36.04 61.44,36.99 v62.79,36.99 | v77.79,37.23 77.79,38.73 77.79,39.21 76.83,40.16 76.16,40.16 JP1.6
  Top 0.61: 70.12,42.86 71.12,42.86 71.12,41.59 72.63,40.08 76.04,40.08 JP1.6
  Bottom 0.406: v62.79,36.99 62.79,37.07 63.18,37.47 69.69,37.47 77.55,37.47 v77.79,37.23
LED_W  (via drill 0.6)
  Top 0.406: 70.33,39.85 70.28,39.85 D6.C 69.22,40.32 | IC1.10 60.23,32.61 61.12,33.5 61.12,34.92 61.12,35.4 61.28,35.56 61.59,35.88 61.91,35.88 63.02,35.88 63.66,35.88 v64.22,36.43 | 73.61,37.47 JP1.5 76.12,37.54 76.36,37.31 76.52,37.15 v76.52,36.43
  Top 0.61: JP1.5 71.68,37.54 71.12,38.1 71.12,39.05 70.33,39.85
  Bottom 0.406: v64.22,36.43 64.45,36.67 76.28,36.67 v76.52,36.43
MISO  (via drill 0.6)
  Top 0.406: IC1.16 58.05,37.47 | IC1.16 58.42,37.41 | JP3B.1 32.86,40.32 v31.75,40.32 | 4.92,37.47 5.08,37.62 JP3A.1 6.99,37.62 7.14,37.78 7.14,38.89 8.1,39.85 9.84,39.85 10.16,40.16 10.16,40.96 v10.32,41.12 | IC1.16 | PB4.1 33.97,41.27 33.02,40.32 JP3B.1 | JP3B.1 | v58.1,41.12 v58.11,41.11 IC1.16
  Bottom 0.406: 31.75,41.43 v31.75,40.32 | 31.75,41.43 10.64,41.43 v10.32,41.12 | 31.75,41.43 57.78,41.43 v58.1,41.12
MOSI  (via drill 0.6)
  Top 0.406: IC1.15 58.99,36.61 59.21,36.83 59.21,40.96 v59.37,41.12 | JP3B.4 37.78,37.94 34.92,37.94 | JP3A.4 12.38,35.08 12.7,35.4 | 12.7,35.4 | 12.7,35.4 12.86,35.56 12.86,36.83 13.49,37.47 v13.49,39.53 | v27.3,38.73 27.78,37.62 28.42,37.62 28.89,37.15 28.89,36.67 34.92,36.67 34.92,37.94 | 34.92,37.94 v34.92,39.53 34.92,40.8 35.4,41.27 | PB3.1 35.88,42.86 35.88,41.75 35.4,41.27 | 35.4,41.27
  Bottom 0.406: v27.3,38.73 26.67,38.89 25.72,39.85 13.81,39.85 v13.49,39.53 13.65,39.69 | v34.92,39.53 35.24,39.85 55.56,39.85 56.2,39.37 57.94,39.37 59.37,40.64 v59.37,41.12
N$1  (via drill 0.6)
  Top 0.813: v78.26,8.73 78.26,9.05 R_G.2
  Bottom 0.61: 73.34,8.73 76.04,8.73
  Bottom 0.813: 76.04,8.73 77.63,8.73 v78.26,8.73 | 73.34,8.73 69.22,8.73 68.6,8.11 G5.K
N$2
  Top 0.254: W5.A@2 62.23,2.54 62.23,3.81 62.34,3.91
  Top 0.813: W5A.A 62.89,3.31 62.34,3.91 61.44,4.92 54.05,4.92 W4A.K W4.K@1
N$3
  Top 0.813: U1A.K U1.P$1 37.28,18.7 37.47,19.05 45.65,19.05 U2A.A U2.P$2
N$4
  Top 0.406: 55.02,42.95 ADC6.1 55.24,42.39 54.61,41.75 54.61,40.16 55.02,39.85 IC1.19
N$5
  Top 0.813: U3A.K U3.P$1 | U4A.A U4.P$2
  Bottom 0.813: U4A.A 56.56,3.6 55.88,4.29 48.2,4.29 U3A.K
N$6  (via drill 0.6)
  Top 0.813: v68.9,15.08 64.99,15.08 U5.P$1 U5A.K | v78.26,18.1 78.26,18.42 R_U.2
  Bottom 0.61: 73.18,16.35 76.04,16.35
  Bottom 0.813: 73.18,16.35 71.91,15.08 v68.9,15.08 | 76.04,16.35 77.15,16.35 77.47,16.35 78.11,16.99 78.26,17.14 v78.26,18.1
N$7  (via drill 0.6)
  Top 0.406: W5.K@1 W5A.K
  Top 0.813: R_W.2 v78.26,1.43 77.79,0.95 67.44,0.95 W5.K@1
N$8
  Top 0.813: W3.K@1 W3A.K 42.03,5.24 48.63,5.24 W4A.A W4.A@2
N$9
  Top 0.406: 53.18,42.86 ADC7.1 53.18,43.02 53.18,42.39 52.62,41.82 IC1.22
N$10
  Top 0.813: U3A.A U3.P$2 | U2A.K U2.P$1
  Bottom 0.61: 45.16,11.51 45.16,13.18
  Bottom 0.813: U3A.A 43.9,5.64 45.16,6.99 45.16,11.51 | 45.16,13.18 45.16,14.05 46.51,15.4 47.78,15.4 U2A.K
N$11
  Bottom 0.813: B1.K 33.78,8.13 B2.A
N$12
  Top 0.406: U5A.A U5.P$2
  Top 0.813: U4A.K U4.P$1
  Bottom 0.61: 60.96,6.83 60.96,8.41
  Bottom 0.813: U5A.A 60.96,16.4 60.96,8.41 | 60.96,6.83 60.96,4.55 59.1,2.69 U4A.K
N$13
  Top 0.813: G2.A 42.52,11.11 34.13,11.11 30.62,7.6 G1.K
N$14
  Bottom 0.813: G2.K 46.44,8.13 G3.A
N$15
  Top 0.813: G4.A 61.36,10.95 56.83,10.95 55.72,9.84 51.28,9.84 49.61,8.17 G3.K
N$16
  Bottom 0.813: G4.K 65.43,8.13 G5.A
N$17
  Top 0.813: B3.A 48.85,11.11 44.29,11.11 43.18,10 38.73,10 36.95,8.21 B2.K
N$18
  Bottom 0.813: B3.K 52.77,8.13 B4.A
N$19
  Top 0.813: B5.A 67.53,10.79 63.18,10.79 61.91,9.53 57.47,9.53 55.94,8 B4.K
N$20  (1 unrouted)
  Top 0.254: 73.66,11.27 73.66,11.43
  Top 0.61: 73.03,11.27 73.66,11.27 76.04,11.27 76.83,11.91 76.83,12.38 76.83,13.02 76.83,13.34 77.15,13.65 R_B.2
  Top 0.813: B5.K 72.61,11.65 72.98,11.27
N$21
  Top 0.61: 29.37,6.67 29.37,8.26
  Top 0.813: RD2.A 29.37,16.18 29.37,8.26 | 29.37,6.67 31.59,4.13 32.23,4.13 32.23,4.09 RD1.K
N$22
  Top 0.813: RD2.K 33.64,14.45 35.62,14.45 RD3.A
N$23
  Bottom 0.813: RD3.K 40.11,8.13 RD4.A
N$24
  Top 0.813: RD5.A 55.18,11.11 50.48,11.11 49.21,9.84 44.93,9.84 43.28,8.19 RD4.K
N$25
  Bottom 0.813: RD5.K 59.1,8.13 RD6.A
N$26
  Bottom 0.61: 64.14,11.59 64.14,13.49
  Bottom 0.813: RD6.K 64.14,9.38 64.14,11.59 | 64.14,13.49 64.14,15.55 RD7.A
N$27
  Top 0.813: R_R.1 30.14,1.43 RD1.A
N$28
  Bottom 0.61: 67.31,6.51 67.31,8.26
  Bottom 0.813: RD7.K 67.31,16.18 67.31,8.26 | 67.31,6.51 67.31,4.44 RD8.A
N$32
  Top 0.406: IC3.1 | IC1.30 47.85,33.41 46.2,31.75 45.09,31.75 43.66,30.32 43.66,29.53 43.66,27.78 44.77,26.67 IC3.1 | IC3.1 45.72,26.67
N$33  (via drill 0.6)
  other vias: 95.41,40.8
N$34
  Top 0.813: W3A.A W3.A@2 | W2A.K W2.K@1
  Bottom 0.61: 38.81,11.75 38.81,13.18
  Bottom 0.813: W3A.A 37.57,4.87 38.81,6.11 38.81,11.75 | 38.81,13.18 38.81,14.45 39.21,14.76 40.57,14.76 W2A.K
N$35
  Top 0.406: L1.3 56.05,26.76 C1.2 55.56,28.05 55.56,28.57 55.82,28.83 IC1.7
N$36
  Top 0.406: C2.2 60.05,28.16 L1.1 58.69,28.63 58.1,29.21 56.99,29.21 56.62,29.59 IC1.8
N$37  (1 unrouted)
  Top 0.61: 73.18,3.65 76.2,3.65
  Top 0.813: T1.3 71.91,4.92 73.18,3.65 | 76.2,3.65 76.36,3.81 77.79,3.81
N$38
  Top 0.61: R1.1 71.12,18.25 70.01,17.14 70.01,14.13 70.48,13.65 70.48,11.59 72.86,9.21 T1.1
N$39
  Top 0.813: JP1T.6 76.36,15.08 77.31,16.03 77.99,16.03 R_U.1
N$40
  Top 0.813: JP1T.5 73.98,12.54 71.79,14.73 R1.2
N$41
  Top 0.813: R_G.1 78.2,6.19 76.36,6.19 75.09,7.46 JP1T.3
N$42
  Top 0.813: JP1T.4 76.83,10 76.99,10.16 R_B.1
N$43
  Bottom 0.813: JP1T.2 74.15,4.92 RD8.K
N$45
  Top 0.813: SJ1.2 D1.A
N$46
  Top 0.813: SJ2.2 D2.A
N$47
  Top 0.406: SJ3.2 65.29,31.11 D3.A
N$48
  Top 0.406: SJ4.2 65.41,33.5 65.88,33.97 66.4,34.49 D4.A
N$50
  Top 0.406: SJ5.2 65.72,38.89 66.2,38.42 66.2,37.83 D5.A
N$51
  Top 0.813: SJ6.2 D6.A
N$52
  Top 0.813: D7.A | SJ7.2 D7.A
N$53
  Top 0.406: SJ1.1 63.05,28.57 SJ2.1 SJ3.1 63.05,32.07 SJ4.1 63.5,33.94 63.5,34.45 63.82,34.77 64.29,34.77 65.25,34.77 65.25,36.04 65.25,37.62 64.77,37.62 63.82,37.62 63.5,37.94 63.5,38.1 63.5,38.55 63.05,38.55 SJ5.1 SJ6.1 SJ7.1 61.91,43.18 R3.1
N$54
  Top 0.813: W1.K@1 W1A.K 53.87,15.4 42.07,15.4 40.74,16.73 W2A.A W2.A@2
N$55  (via drill 0.6)
  Top 0.406: PB2.1 45.56,42.86 45.56,41.27 46.83,40.01 47.62,40.01 48.26,39.37 v48.26,38.73 | IC1.14 56.74,35.81 arc-90 v56.59,35.96
  Bottom 0.406: v56.59,35.96 56.36,36.2 50.32,36.2 48.26,38.26 v48.26,38.73
N$56  (via drill 0.6)
  other vias: 96.52,39.53
N$57  (via drill 0.6)
  other vias: 95.41,39.53
N$58  (via drill 0.6)
  other vias: 96.52,40.8
N$63  (via drill 0.6)
  other vias: 4.6,40.8
N$64  (via drill 0.6)
  other vias: 4.6,39.53
N$65  (via drill 0.6)
  other vias: 3.49,39.53
N$68  (via drill 0.6)
  other vias: 3.49,40.8
N$79  (via drill 0.6)
  other vias: 73.66,42.7
N$80  (via drill 0.6)
  other vias: 74.93,42.7
RE/DE  (via drill 0.6)
  Top 0.406: IC3.3 46.51,29.21 IC3.3 | IC3.3 46.99,29.21 | 69.53,29.05 69.8,29.32 D2.C 69.8,29.1 70.17,28.73 v73.5,28.73 | 46.67,27.94 IC3.2 48.1,27.94 v48.58,28.42 | v48.58,28.42 | 48.1,29.21 48.1,29.05 48.1,28.89 v48.58,28.42 | 48.1,29.21 48.1,30.96 48.1,31.27 48.63,31.81 48.95,31.81 IC1.32 | IC3.3 | 48.1,29.21 IC3.3
  Bottom 0.406: v48.58,28.42 48.9,28.1 69.53,28.1 70.17,28.73 v73.5,28.73
RS485A  (via drill 0.6)
  Top 0.254: XR.3 81.28,33.02
  Top 0.406: A_L.1 2.86,30.16 v1.59,29.53 4.13,30.96 12.06,30.96 13.02,30.96 13.49,31.43 13.49,32.86 14.45,33.81 14.45,36.35 14.92,36.83 15.72,36.83 15.79,36.91 XL.3 | IC3.6 | IC3.6 42.07,29.21 v42.62,28.42 | XR.3 81.81,33.02 81.81,33.18 84.77,33.18 85.41,32.54 85.41,29.84 86.52,28.73 87,28.73 88.42,28.73 v88.98,28.26 | 95.09,30 95.09,30.48 95.41,30.16 A_R.1 97.95,29.53 v98.42,29.53
  Bottom 0.254: 76.2,26.51 76.2,26.67
  Bottom 0.406: v1.59,29.53 1.59,28.89 3.97,26.51 40.16,26.51 42.07,28.42 v42.62,28.42 42.62,28.18 43.18,27.62 43.26,27.54 44.29,26.51 45.88,26.51 76.2,26.51 85.57,26.51 88.11,26.51 88.9,27.3 88.98,27.39 v88.98,28.26 97.16,28.26 v98.42,29.53
RS485B  (via drill 0.6)
  Top 0.254: 95.25,26.67 96.52,26.67 B_R.1 | 86.2,30.48 86.36,30.48
  Top 0.406: v1.59,26.67 2.22,26.51 B_L.1 3.81,28.1 5.87,28.1 5.87,30 6.03,30.16 13.65,30.16 14.45,30.96 14.45,32.54 15,33.09 XL.6 | v97.31,26.19 B_R.1 | B_R.1 | 40.96,27.94 | 40.96,27.94 IC3.7 | XR.6 85.33,36.91 85.57,36.67 85.57,33.66 86.2,33.02 86.2,30.48 86.2,30.32 86.36,30.16 86.84,29.69 90.01,29.69 90.01,27.15 90.01,26.35 v89.69,26.04 | 40.96,27.94 41.43,27.94 41.91,27.46 42.23,27.15 v42.23,26.75 | 40.96,27.94
  Bottom 0.406: v97.31,26.19 96.84,25.72 89.69,25.72 | 89.69,25.72 88.27,25.72 43.5,25.72 42.23,25.72 | 42.23,25.72 2.54,25.72 v1.59,26.67 | 89.69,25.72 v89.69,26.04 | 89.69,25.72 | 42.23,25.72 v42.23,26.75
RST  (via drill 0.6)
  Top 0.406: IC1.29 46.75,34.21 44.93,34.21 v44.85,34.29 44.77,34.29 44.45,34.61 43.78,34.61 43.46,34.92 R2.1 | v3.33,32.54 JP3A.5 | JP3B.5 v32.38,34.29 | JP3B.5 | v10.08,29.05 21.27,29.05 24.45,32.23 24.77,32.54 27.46,32.54 30.16,35.24 JP3B.5
  Bottom 0.406: v44.85,34.29 44.45,34.61 34.45,34.61 32.7,34.61 v32.38,34.29 | v3.33,32.54 6.83,29.05 v10.08,29.05
SCK  (via drill 0.6)
  Top 0.254: 31.75,38.1 JP3B.3
  Top 0.406: 32.07,37.78 32.46,37.78 JP3B.3 | JP3B.3 32.86,37.78 JP3B.3 | JP3B.3 33.66,37.78 | JP3A.3 7.14,36.51 8.26,36.51 8.26,38.26 8.89,38.89 10.48,38.89 v11.91,40.32 | 31.75,38.1 31.11,38.1 30.96,37.94 30.96,38.42 29.69,39.69 v29.69,40.32 29.69,40.48 30.96,41.75 31.43,41.75 31.43,42.86 PB5.1 | IC1.17 56.62,40.11 v56.83,40.4
  Bottom 0.406: v56.83,40.4 56.52,40.64 34.13,40.64 32.5,39.17 30.21,39.17 29.69,39.69 v29.69,40.32 29.53,40.64 12.22,40.64 v11.91,40.32
SPARE_B1  (via drill 0.6)
  Top 0.254: SW1.2 88.9,36.83
  Top 0.406: v25.24,34.77 25.24,33.66 23.95,33.66 JP2.3 | IC1.13 57.23,35.01 56.83,34.61 56.59,34.37 v56.59,33.89 | 40.01,36.35 40.01,36.04 | 40.01,36.04 | v40.01,35.72 40.01,35.4 | v40.01,35.72 40.01,36.04 | v40.01,35.72 40.01,36.35 | 40.01,36.35 | 40.01,36.35 40.01,41.12 38.73,42.39 38.73,42.86 PB1.1 | v87,39.69 87,38.73 SW1.2
  Bottom 0.406: v25.24,34.77 26.04,34.77 26.83,35.4 40.01,35.4 | 40.01,35.4 49.05,35.4 49.21,35.4 49.85,34.77 54.93,34.77 55.24,34.45 55.56,34.13 55.88,34.13 58.1,34.13 | 40.01,35.4 v40.01,35.72 | 58.1,34.13 62.39,38.26 64.77,38.26 67.15,38.26 74.61,38.26 78.9,38.26 79.06,38.1 79.53,37.62 80.64,37.62 83.03,37.62 83.34,37.62 84.45,38.73 86.04,38.73 v87,39.69 | 58.1,34.13 56.83,34.13 v56.59,33.89
SPARE_C3  (via drill 0.6)
  Top 0.406: IC1.26 48.64,36.61 | v28.73,38.73 28.26,39.51 JP2.6 26.66,41.59 28.1,41.59 PC3.1 | IC1.26 48.16,36.61 46.83,37.94 v46.83,38.73 | IC1.26 49.91,36.61 | v85.09,40.64 85.72,39.85 85.72,37.99 SW1.3
  Bottom 0.406: v28.73,38.73 28.89,38.42 34.13,38.42 35.24,38.42 36.2,38.42 36.83,39.05 46.51,39.05 v46.83,38.73 46.83,37.94 47.55,37.23 48.28,37.23 50.1,35.48 54.77,35.48 55.32,35.48 55.88,34.92 56.67,34.92 57.87,34.92 57.98,35.04 | 57.98,35.04 57.94,35 | 57.98,35.04 62.15,39.05 74.61,39.05 78.74,39.05 79.22,39.05 79.53,38.73 79.85,38.42 81.76,38.42 83.03,38.42 84.61,40.01 | 84.61,40.01 | 84.61,40.01 v85.09,40.64
SPARE_C4  (via drill 0.6)
  Top 0.406: JP2.5 23.96,38.89 | IC1.27 47.7,35.81 45.56,37.94 v45.4,37.94 45.4,39.05 44.77,39.69 43.49,39.69 R4.1 | v24.92,37.62 24.92,38.73 23.95,38.73 JP2.5 | PC4.1 arc-90 22.07,42.86 22.07,41.12 22.54,40.64 22.54,39.21 23.02,38.73 23.8,38.73 JP2.5
  Bottom 0.406: 29.05,37.62 | v24.92,37.62 29.05,37.62 | 29.05,37.62 45.09,37.62 v45.4,37.94
SPARE_C5  (via drill 0.6)
  Top 0.406: 27.78,36.35 27.7,36.27 JP2.4 | v25.24,36.2 26.33,36.35 JP2.4 | IC1.28 47.23,35.01 45.72,36.51 v45.24,36.51 44.93,36.83 44.61,36.83 43.66,37.78 R5.1 | PC5.1 23.65,42.7 23.97,42.39 23.97,40.32 24.29,40.01 25.56,40.01 26.19,39.37 26.19,36.27 JP2.4
  Bottom 0.406: v25.24,36.2 25.88,36.2 26.51,36.83 36.99,36.83 37.78,36.83 44.93,36.83 v45.24,36.51
TXD  (via drill 0.6)
  Top 0.406: 69.69,26.94 D1.C 69.8,26.62 v70.8,27.62 | 46.04,30.48 IC3.4 | IC1.31 48.16,32.61 46.04,30.48 | 46.04,30.48 45.24,30.48 44.77,30 44.69,29.93 v44.69,28.42
  Bottom 0.406: v70.8,27.62 70.48,27.3 46.51,27.3 45.8,27.3 v44.69,28.42
V+
  Top 0.406: U1A.A U1.P$2
  Top 0.813: G1.A 27.46,6.9 27.46,3.34 27.46,3.02 26.51,2.06 26.51,1.46 R_R.2 26.51,1.3 26.51,1.91 | W1A.A W1.A@2
  Bottom 0.813: G1.A 31.24,10.68 B1.A 31.24,14.3 U1A.A 34.41,18.77 arc90 34.29,18.89 | JP1T.7 73.53,18.89 53.34,18.89 | 34.29,18.89 20.76,18.89 arc90 P+18T.1 | 34.29,18.89 53.34,18.89 | W1A.A 53.4,18.83 53.34,18.89
VCC
  Top 0.406: 54.45,32.23 55.02,31.66 IC1.6 55.02,29.3 53.13,27.41 C6.2 53.18,26.93 53.18,26.83 52.55,26.83 52.55,25.88 52.39,25.72 40.42,25.72 IC3.8 | 41.56,33.47 41.12,33.02 40.96,32.7 | 54.45,32.23 54.45,37.47 54.61,37.62 55.56,37.62 55.82,37.88 IC1.18 55.82,39.75 55.72,39.85 55.72,40.75 C5.1 | IC1.4 53.42,31.19 54.45,32.23
  Top 0.61: PAD3.1 PAD2.1
  Top 0.813: 38.73,26.67 IC4.1 | 38.73,26.67 IC3.8 | IC3.8 | C4.1 38.58,26.83 38.73,26.67 | JP2.2 28.49,31.19 29.21,31.91 C4.1 | C4.1 40.01,31.91 41.56,33.47 R2.2 41.56,37.78 R5.2 41.59,39.69 R4.2 41.43,39.85 41.43,41.75 41.27,41.91 PAD3.1
(copper drawn outside any net)
  shapes: Top area x6

### Text on the board
tPlace: 64 | 7 | 1 | 1 | 1 | 32 | +18 | +18 | 16 | 6 | 8 | 6 | 4 | A | 2 | A | 1 | B | 6 | 1 | B | 7 | +18V | 1 | GND | +5V | B1 | C5 | 6 | C4 | 1 | C3
tNames: GND (3x) | +5V
bStop: PentaFnord | ControlBoard 0.2b | https://www.c3d2.de/wiki/PentaFnord | PentaFnord | LedBoard 0.2b